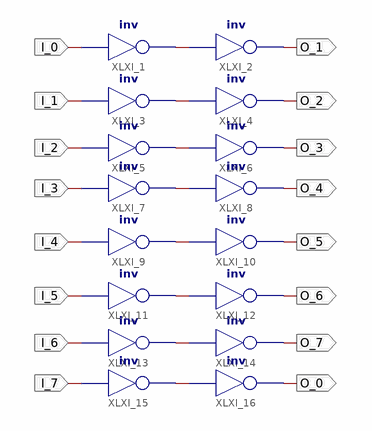
[diagram p0: schematic sheet 1]
// Xilinx ISE schematic shiftbit.sch (spartan6) as structural Verilog: 16 symbols, 16 ports
module shiftbit (
  input  I_0,
  input  I_1,
  input  I_2,
  input  I_3,
  input  I_4,
  input  I_5,
  input  I_6,
  input  I_7,
  output O_1,
  output O_2,
  output O_3,
  output O_4,
  output O_5,
  output O_6,
  output O_7,
  output O_0
);

  wire XLXN_1, XLXN_2, XLXN_3, XLXN_4, XLXN_5, XLXN_6, XLXN_7, XLXN_8;

  not XLXI_1 (XLXN_1, I_0);
  not XLXI_2 (O_1, XLXN_1);
  not XLXI_3 (XLXN_2, I_1);
  not XLXI_4 (O_2, XLXN_2);
  not XLXI_5 (XLXN_3, I_2);
  not XLXI_6 (O_3, XLXN_3);
  not XLXI_7 (XLXN_4, I_3);
  not XLXI_8 (O_4, XLXN_4);
  not XLXI_9 (XLXN_5, I_4);
  not XLXI_10 (O_5, XLXN_5);
  not XLXI_11 (XLXN_6, I_5);
  not XLXI_12 (O_6, XLXN_6);
  not XLXI_13 (XLXN_7, I_6);
  not XLXI_14 (O_7, XLXN_7);
  not XLXI_15 (XLXN_8, I_7);
  not XLXI_16 (O_0, XLXN_8);
endmodule
